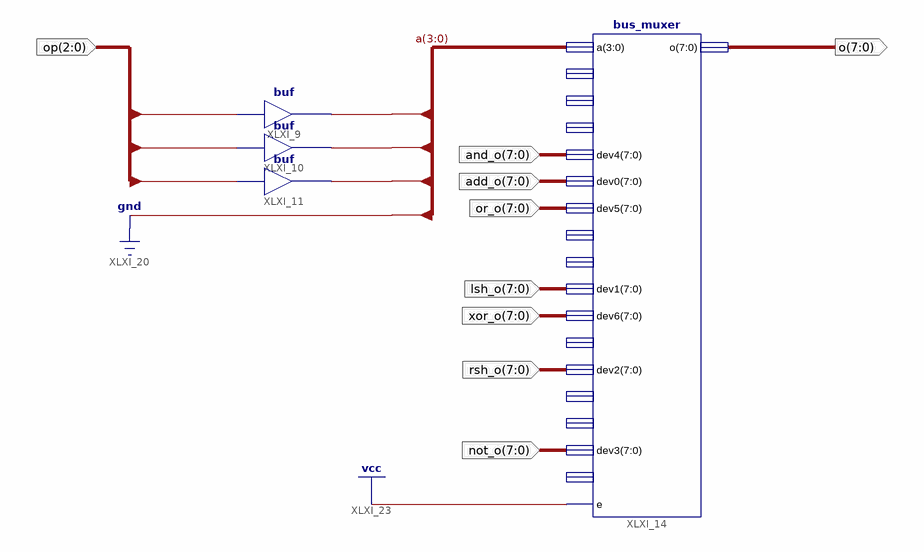
[diagram p0: schematic sheet 1]
// Xilinx ISE schematic alu_output_muxer.sch (aspartan6) as structural Verilog: 4 symbols, 9 ports
module alu_output_muxer (
  input  [2:0] op,
  input  [7:0] add_o,
  input  [7:0] lsh_o,
  input  [7:0] rsh_o,
  input  [7:0] not_o,
  input  [7:0] or_o,
  input  [7:0] xor_o,
  input  [7:0] and_o,
  output [7:0] o
);

  wire [2:0] a;

  buf XLXI_9 (a[0], op[0]);
  buf XLXI_10 (a[1], op[1]);
  buf XLXI_11 (a[2], op[2]);
  bus_muxer XLXI_14 (
    .a({1'b0, a}), .dev0(add_o), .dev1(lsh_o), .dev2(rsh_o), .dev3(not_o), .dev4(and_o), .dev5(or_o),
    .dev6(xor_o), .e(1'b1), .o(o));  // open: dev10, dev11, dev12, dev13, dev14, dev15, dev7, dev8, dev9
endmodule
